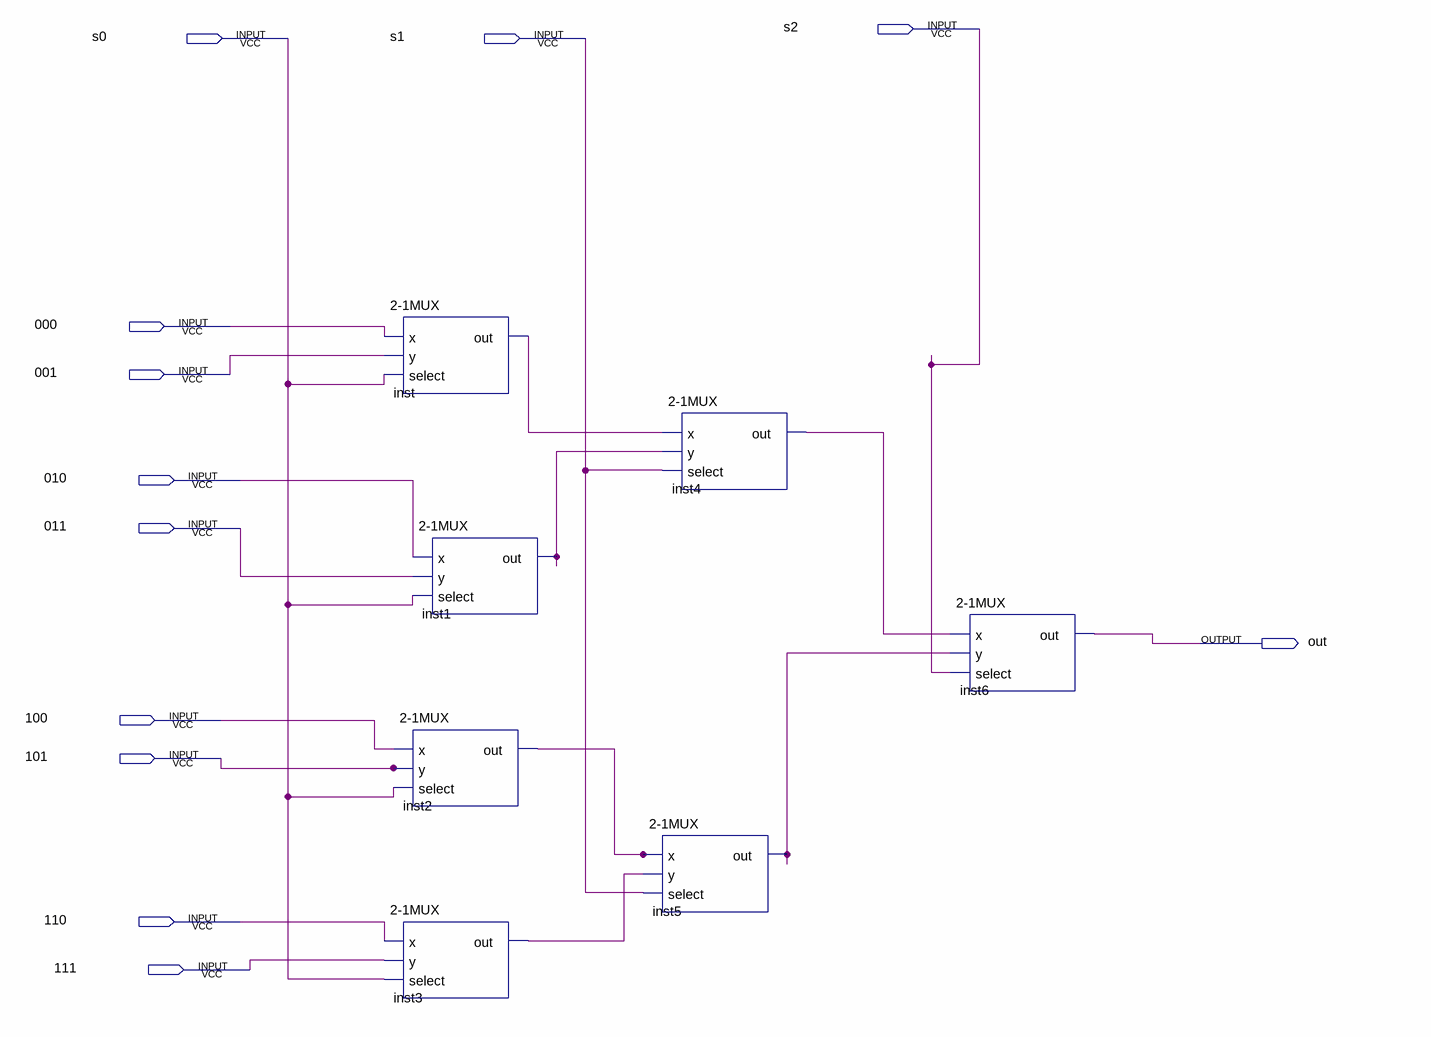
[diagram p0: schematic sheet]
// Quartus schematic 8-1MUX.bdf as structural Verilog: 7 symbols, 12 pins
module \8-1MUX  (
  input  s2,
  input  s0,
  input  s1,
  input  \000 ,
  input  \001 ,
  input  \010 ,
  input  \011 ,
  input  \100 ,
  input  \101 ,
  input  \110 ,
  input  \111 ,
  output out
);

  wire inst1_out, inst2_out, inst3_out, inst4_out, inst5_out, inst_out;

  \2-1MUX  inst (.x(\000 ), .y(\001 ), .select(s0), .out(inst_out));
  \2-1MUX  inst1 (.x(\010 ), .y(\011 ), .select(s0), .out(inst1_out));
  \2-1MUX  inst2 (.x(\100 ), .y(\101 ), .select(s0), .out(inst2_out));
  \2-1MUX  inst3 (.x(\110 ), .y(\111 ), .select(s0), .out(inst3_out));
  \2-1MUX  inst5 (.x(inst2_out), .y(inst3_out), .select(s1), .out(inst5_out));
  \2-1MUX  inst4 (.x(inst_out), .y(inst1_out), .select(s1), .out(inst4_out));
  \2-1MUX  inst6 (.x(inst4_out), .y(inst5_out), .select(s2), .out(out));
endmodule
